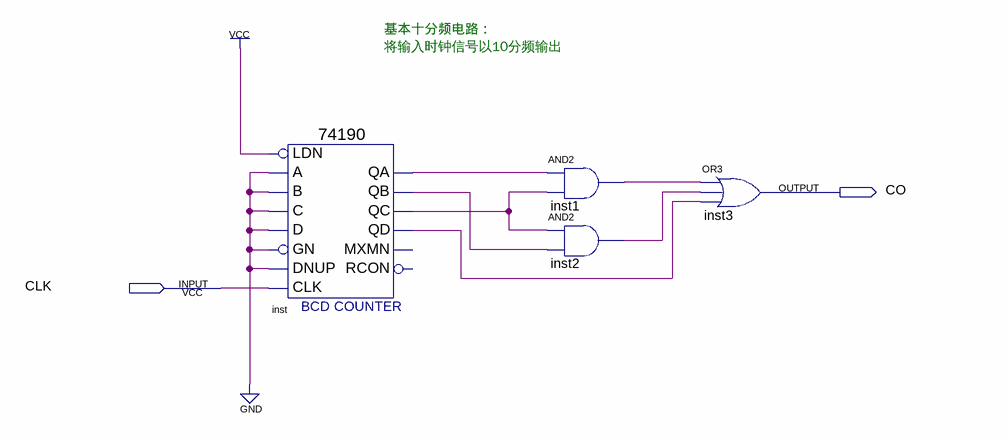
[diagram p0: schematic sheet]
// Quartus schematic 10fenpin.bdf as structural Verilog: 4 symbols, 2 pins
module \10fenpin  (
  input  CLK,
  output CO
);

  wire inst1_out, inst2_out, inst_qa, inst_qb, inst_qc, inst_qd;

  \74190  inst (
    .LDN(1'b1), .A(1'b0), .C(1'b0), .B(1'b0), .D(1'b0), .GN(1'b0), .CLK(CLK), .DNUP(1'b0), .QA(inst_qa),
    .QB(inst_qb), .QD(inst_qd), .QC(inst_qc));  // open: MXMN, RCON
  and inst1 (inst1_out, inst_qa, inst_qc);
  and inst2 (inst2_out, inst_qc, inst_qb);
  or inst3 (CO, inst1_out, inst2_out, inst_qd);

  // Notes on the sheet:
  //   基本十分频电路：
  //   将输入时钟信号以10分频输出
endmodule
